# Altium project Ultimate Strat.PrjPcb
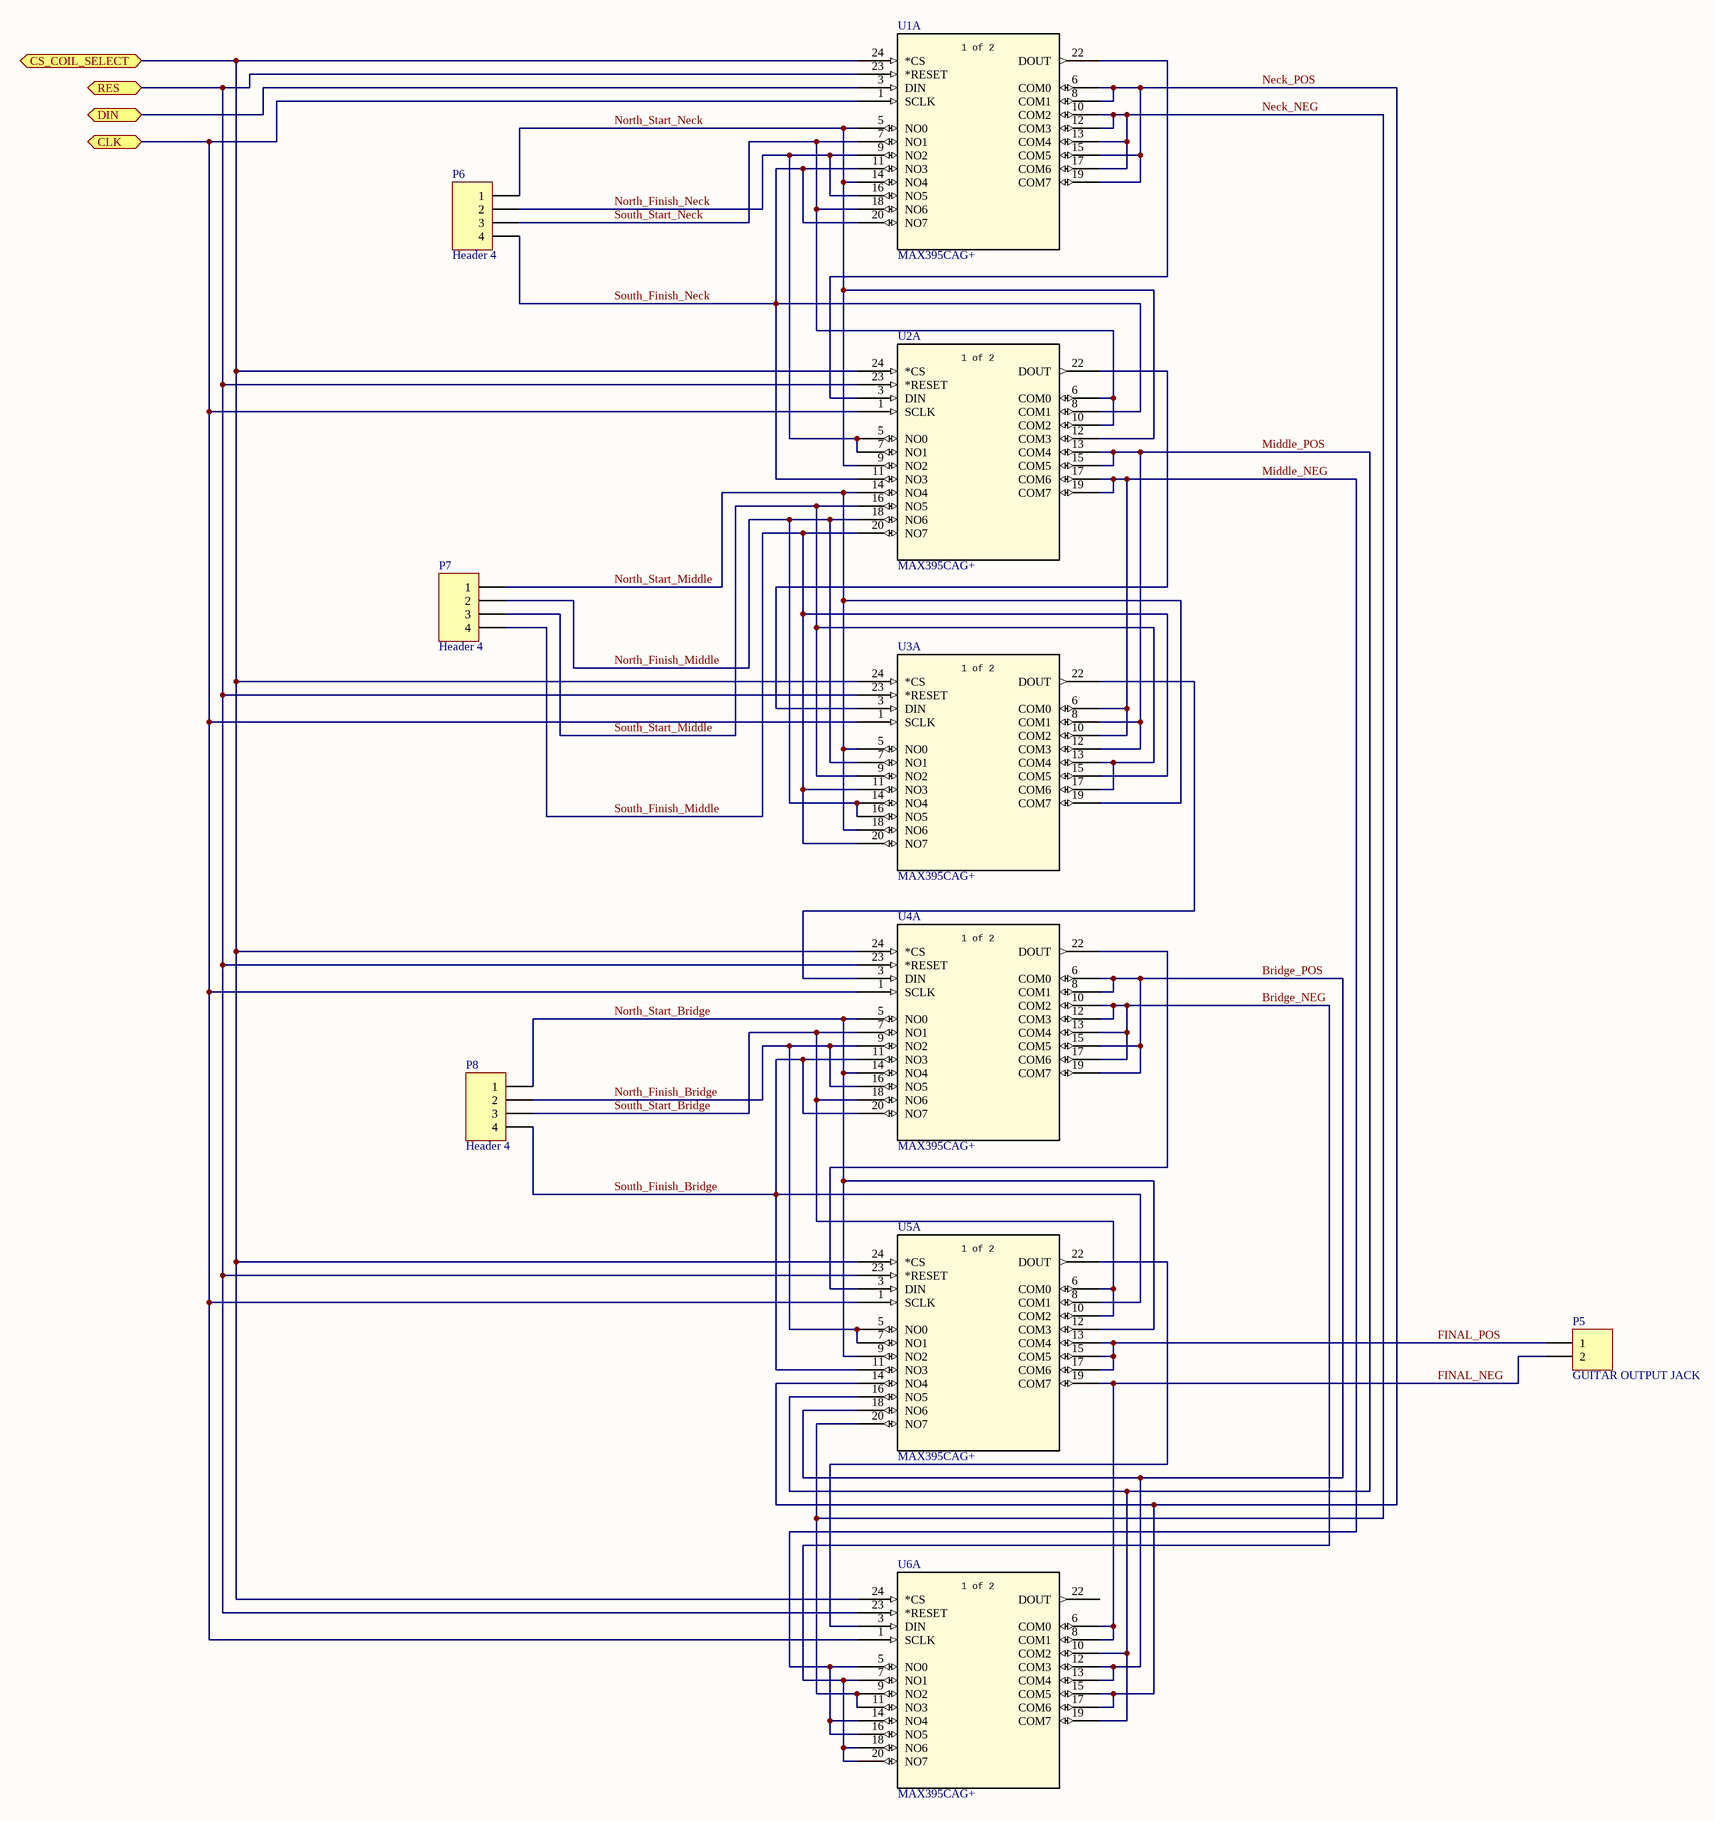
[diagram p0: Coil Switching System.SchDoc]
3 sheets, 37 parts. Net scope: flat (ports and power ports of the same name join across sheets).
Board file: Ultimate_Strat_PCB.PcbDoc
Sheets:
  Coil Switching System.SchDoc
  Power System.SchDoc
  Microcontroller System.SchDoc

## Sheet Coil Switching System.SchDoc
size C

### Parts
P5  GUITAR OUTPUT JACK  [HDR1X2]
P6  Header 4  [HDR1X4]
P7  Header 4  [HDR1X4]
P8  Header 4  [HDR1X4]
U1  MAX395CAG+  [21-0056C_24_MXM]  (part A of 2)
U2  MAX395CAG+  [21-0056C_24_MXM]  (part A of 2)
U3  MAX395CAG+  [21-0056C_24_MXM]  (part A of 2)
U4  MAX395CAG+  [21-0056C_24_MXM]  (part A of 2)
U5  MAX395CAG+  [21-0056C_24_MXM]  (part A of 2)
U6  MAX395CAG+  [21-0056C_24_MXM]  (part A of 2)

### Ports
CLK, CS_COIL_SELECT, DIN, RES

### Nets
Bridge_NEG: U4.10(COM2) U4.12(COM3) U4.13(COM4) U4.17(COM6) U6.7(NO1) U6.18(NO6) U6.20(NO7)
Bridge_POS: U4.6(COM0) U4.8(COM1) U4.15(COM5) U4.19(COM7) U5.18(NO6) U6.12(COM3) U6.13(COM4)
FINAL_NEG: P5.2 U5.19(COM7) U6.6(COM0) U6.8(COM1)
FINAL_POS: P5.1 U5.13(COM4) U5.15(COM5) U5.17(COM6)
Middle_NEG: U2.17(COM6) U2.19(COM7) U3.6(COM0) U3.10(COM2) U6.5(NO0) U6.14(NO4) U6.16(NO5)
Middle_POS: U2.13(COM4) U2.15(COM5) U3.8(COM1) U3.12(COM3) U5.16(NO5) U6.10(COM2) U6.19(COM7)
Neck_NEG: U1.10(COM2) U1.12(COM3) U1.13(COM4) U1.17(COM6) U5.20(NO7) U6.9(NO2) U6.11(NO3)
Neck_POS: U1.6(COM0) U1.8(COM1) U1.15(COM5) U1.19(COM7) U5.14(NO4) U6.15(COM5) U6.17(COM6)
North_Finish_Bridge: P8.2 U4.9(NO2) U4.16(NO5) U5.5(NO0) U5.7(NO1)
North_Finish_Middle: P7.2 U2.18(NO6) U3.7(NO1) U3.14(NO4) U3.16(NO5)
North_Finish_Neck: P6.2 U1.9(NO2) U1.16(NO5) U2.5(NO0) U2.7(NO1)
North_Start_Bridge: P8.1 U4.5(NO0) U4.14(NO4) U5.9(NO2) U5.12(COM3)
North_Start_Middle: P7.1 U2.14(NO4) U3.5(NO0) U3.18(NO6) U3.19(COM7)
North_Start_Neck: P6.1 U1.5(NO0) U1.14(NO4) U2.9(NO2) U2.12(COM3)
South_Finish_Bridge: P8.4 U4.11(NO3) U4.20(NO7) U5.8(COM1) U5.11(NO3)
South_Finish_Middle: P7.4 U2.20(NO7) U3.11(NO3) U3.15(COM5) U3.20(NO7)
South_Finish_Neck: P6.4 U1.11(NO3) U1.20(NO7) U2.8(COM1) U2.11(NO3)
South_Start_Bridge: P8.3 U4.7(NO1) U4.18(NO6) U5.6(COM0) U5.10(COM2)
South_Start_Middle: P7.3 U2.16(NO5) U3.9(NO2) U3.13(COM4) U3.17(COM6)
South_Start_Neck: P6.3 U1.7(NO1) U1.18(NO6) U2.6(COM0) U2.10(COM2)
NetU1_1: U1.1(SCLK) U2.1(SCLK) U3.1(SCLK) U4.1(SCLK) U5.1(SCLK) U6.1(SCLK) ; port CLK
NetU1_3: U1.3(DIN) ; port DIN
NetU1_22: U1.22(DOUT) U2.3(DIN)
NetU1_23: U1.23(*RESET) U2.23(*RESET) U3.23(*RESET) U4.23(*RESET) U5.23(*RESET) U6.23(*RESET) ; port RES
NetU1_24: U1.24(*CS) U2.24(*CS) U3.24(*CS) U4.24(*CS) U5.24(*CS) U6.24(*CS) ; port CS_COIL_SELECT
NetU2_22: U2.22(DOUT) U3.3(DIN)
NetU3_22: U3.22(DOUT) U4.3(DIN)
NetU4_22: U4.22(DOUT) U5.3(DIN)
NetU5_22: U5.22(DOUT) U6.3(DIN)

Not connected (* = marked no-connect by the designer): U6 22(DOUT)

### Notes on the sheet
- (in symbol MAX395CAG+, part A) 1 of 2

### Library data of the parts
P5 = Header 2: Header, 2-Pin; LatestRevisionDate: 17-Jul-2002; LatestRevisionNote: Re-released for DXP Platform.; Publisher: Altium Limited
P6-P8 = Header 4: Header, 4-Pin; LatestRevisionDate: 17-Jul-2002; LatestRevisionNote: Re-released for DXP Platform.; Publisher: Altium Limited
U1-U6 = MAX395CAG+: No Description Available; SourceLibrary: Maxim_2014-05-21; Built_By: EMA_UL_Team; Vendor: Maxim Integrated Products; Manufacturer_Part_Number: MAX395CAG+; Copyright: Copyright (C) 2018 Accelerated Designs. All rights reserved; RefDes: RefDes; Type: DEV

## Sheet Power System.SchDoc
size A
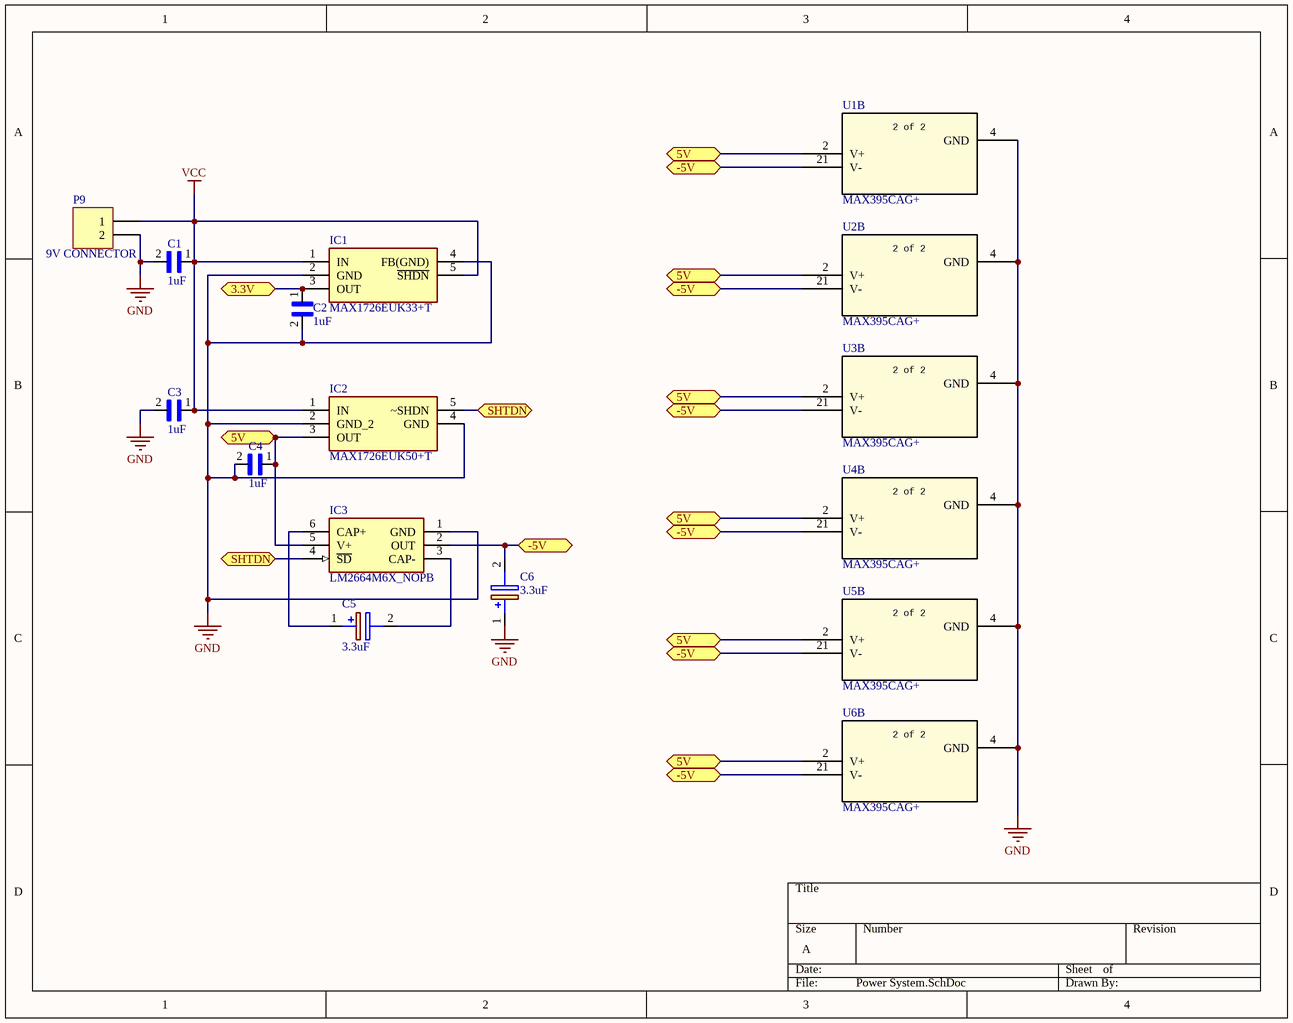
[diagram p1: Power System.SchDoc]

### Parts
C1  1uF  [CAPC2012X135N]
C2  1uF  [CAPC2012X135N]
C3  1uF  [CAPC2012X135N]
C4  1uF  [CAPC2012X135N]
C5  3.3uF  [CAPAE430X550N]
C6  3.3uF  [CAPAE430X550N]
IC1  MAX1726EUK33+T  [SOT95P280X145-5N]
IC2  MAX1726EUK50+T  [SOT95P280X145-5N]
IC3  LM2664M6X_NOPB  [SOT95P280X145-6N]
P9  9V CONNECTOR  [HDR1X2]
U1  MAX395CAG+  [21-0056C_24_MXM]  (part B of 2)
U2  MAX395CAG+  [21-0056C_24_MXM]  (part B of 2)
U3  MAX395CAG+  [21-0056C_24_MXM]  (part B of 2)
U4  MAX395CAG+  [21-0056C_24_MXM]  (part B of 2)
U5  MAX395CAG+  [21-0056C_24_MXM]  (part B of 2)
U6  MAX395CAG+  [21-0056C_24_MXM]  (part B of 2)

### Ports
3.3V, 5V, -5V, SHTDN

### Nets
GND: C1.2 C2.2 C3.2 C4.2 C6.1(+) IC1.2(GND) IC1.4(FB(GND)) IC2.2(GND_2) IC2.4(GND) IC3.1(GND) P9.2 U1.4(GND) U2.4(GND) U3.4(GND) U4.4(GND) U5.4(GND) U6.4(GND)
VCC: C1.1 C3.1 IC1.1(IN) IC1.5(~{SHDN}) IC2.1(IN) P9.1
NetC2_1: C2.1 IC1.3(OUT) ; port 3.3V
NetC4_1: C4.1 IC2.3(OUT) IC3.5(V+) U1.2(V+) U2.2(V+) U3.2(V+) U4.2(V+) U5.2(V+) U6.2(V+) ; port 5V
NetC5_1: C5.1(+) IC3.6(CAP+)
NetC5_2: C5.2(-) IC3.3(CAP-)
NetC6_2: C6.2(-) IC3.2(OUT) U1.21(V-) U2.21(V-) U3.21(V-) U4.21(V-) U5.21(V-) U6.21(V-) ; port -5V
NetIC2_5: IC2.5(~SHDN) IC3.4(~{SD}) ; port SHTDN

### Notes on the sheet
- (in symbol MAX395CAG+, part B) 2 of 2

### Library data of the parts
C1-C4 = TMK212B7105KGHTR: 1ÂµF Â±10% 25V Ceramic Capacitor X7R 0805 _2012 Metric_; MF: Taiyo Yuden; Digi-Key_Part_Number: 587-6357-1-ND; Package: 2012 Taiyo Yuden; MP: TMK212B7105KGHTR; SnapEDA_Link: https://www.snapeda.com/parts/TMK212B7105KGHTR/Taiyo%20Yuden/view-part/1813294/?ref=snap; Digi-Key_Purchase_URL: https://www.digikey.ca/product-detail/en/taiyo-yuden/TMK212B7105KGHTR/587-6357-1-ND/9949943?utm_source=snapeda&utm_medium=aggregator&utm_campaign=symbol; Value: *
C5 C6 = 16SVP3R3M: Capacitor Polarised; Manufacturer_Name: Panasonic; Datasheet Link: https://industrial.panasonic.com/cdbs/www-data/pdf/AAB8000/AAB8000C193.pdf; Height: 5.5mm; Manufacturer_Part_Number: 16SVP3R3M; Arrow Part Number: 16SVP3R3M; Arrow Price/Stock: https://www.arrow.com/en/products/16svp3r3m/panasonic; Mouser Part Number: 667-16SVP3R3M; Mouser Price/Stock: https://www.mouser.com/Search/Refine.aspx?Keyword=667-16SVP3R3M
IC1 = MAX1726EUK33+T: Integrated Circuit; Manufacturer_Name: Maxim Integrated; Datasheet Link: https://datasheets.maximintegrated.com/en/ds/MAX1725-MAX1726.pdf; Height: 1.45mm; Manufacturer_Part_Number: MAX1726EUK33+T; Arrow Part Number: MAX1726EUK33+T; Mouser Part Number: 700-MAX1726EUK33T; Mouser Price/Stock: https://www.mouser.com/Search/Refine.aspx?Keyword=700-MAX1726EUK33T
IC2 = MAX1726EUK50+T: Integrated Circuit; Manufacturer_Name: Maxim Integrated; Datasheet Link: http://componentsearchengine.com/Datasheets/1/MAX1726EUK50+T.pdf; Manufacturer_Part_Number: MAX1726EUK50+T; Arrow Part Number: MAX1726EUK50+T; Mouser Part Number: 700-MAX1726EUK50T; Mouser Price/Stock: https://www.mouser.co.uk/ProductDetail/Maxim-Integrated/MAX1726EUK50%2bT?qs=Jw2w9zrI6w%252Bbrdx6zz2S%2FQ%3D%3D
IC3 = LM2664M6X_NOPB: Integrated Circuit; Manufacturer_Name: Texas Instruments; Manufacturer_Part_Number: LM2664M6X/NOPB; Datasheet Link: https://componentsearchengine.com/Datasheets/2/LM2664M6X_NOPB.pdf; Height: 1.45mm; Arrow Part Number: LM2664M6X/NOPB; Arrow Price/Stock: https://www.arrow.com/en/products/lm2664m6xnopb/texas-instruments; Mouser Part Number: 926-LM2664M6X/NOPB; Mouser Price/Stock: https://www.mouser.co.uk/ProductDetail/Texas-Instruments/LM2664M6X-NOPB?qs=X1J7HmVL2ZHEhyIijWLH%252BA%3D%3D
P9 = Header 2: Header, 2-Pin; LatestRevisionDate: 17-Jul-2002; LatestRevisionNote: Re-released for DXP Platform.; Publisher: Altium Limited
U1-U6 = MAX395CAG+: as U1 on sheet Coil Switching System; Manufacturer_Part_Number: MAX395CAG+; Copyright: Copyright (C) 2018 Accelerated Designs. All rights reserved; RefDes: RefDes; Type: DEV

## Sheet Microcontroller System.SchDoc
size A
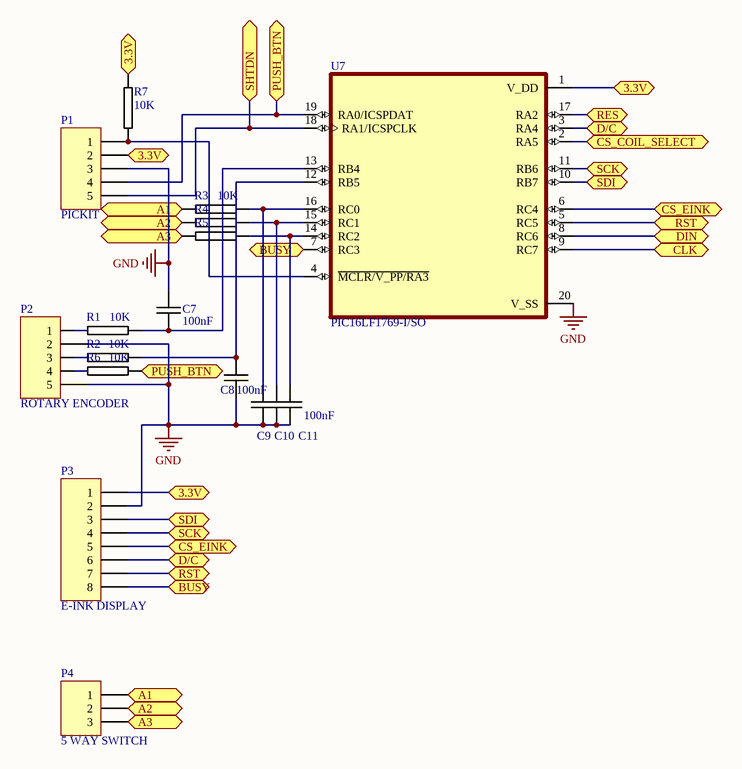
[diagram p2: Microcontroller System.SchDoc]

### Parts
C7  100nF  [0805C-TBD]
C8  100nF  [0805C-TBD]
C9  100nF  [0805C-TBD]  (value not drawn)
C10  100nF  [0805C-TBD]  (value not drawn)
C11  100nF  [0805C-TBD]
P1  PICKIT  [HDR1X5]
P2  ROTARY ENCODER  [HDR1X5]
P3  E-INK DISPLAY  [HDR1X8]
P4  5 WAY SWITCH  [HDR1X3]
R1  10K  [0805R-10K]
R2  10K  [0805R-10K]
R3  10K  [0805R-10K]
R4  10K  [0805R-10K]  (value not drawn)
R5  10K  [0805R-10K]  (value not drawn)
R6  10K  [0805R-10K]
R7  10K  [0805R-10K]
U7  PIC16LF1769-I/SO  [SOIC127P1032X265-20N]

### Ports
3.3V, A1, A2, A3, BUSY, CLK, CS_COIL_SELECT, CS_EINK, D/C, DIN, PUSH_BTN, RES, RST, SCK, SDI, SHTDN

### Nets
GND: C7.1 C8.2 C9.2 C10.2 C11.2 P1.3 P2.2 P2.5 P3.2 U7.20(V_SS)
NetC2_1: P1.2 P3.1 R7.2 U7.1(V_DD) ; port 3.3V
NetC7_2: C7.2 R1.2 U7.13(RB4)
NetC8_1: C8.1 R2.2 U7.12(RB5)
NetC9_1: C9.1 R3.2 U7.16(RC0)
NetC10_1: C10.1 R4.2 U7.15(RC1)
NetC11_1: C11.1 R5.2 U7.14(RC2)
NetIC2_5: P1.5 U7.18(RA1/ICSPCLK) ; port SHTDN
NetP1_1: P1.1 R7.1 U7.4(~{MCLR/V_PP/RA3})
NetP1_4: P1.4 R6.2 U7.19(RA0/ICSPDAT) ; port PUSH_BTN
NetP2_1: P2.1 R1.1
NetP2_3: P2.3 R2.1
NetP2_4: P2.4 R6.1
NetP3_3: P3.3 U7.10(RB7) ; port SDI
NetP3_4: P3.4 U7.11(RB6) ; port SCK
NetP3_5: P3.5 U7.6(RC4) ; port CS_EINK
NetP3_6: P3.6 U7.3(RA4) ; port D/C
NetP3_7: P3.7 U7.5(RC5) ; port RST
NetP3_8: P3.8 U7.7(RC3) ; port BUSY
NetP4_1: P4.1 R3.1 ; port A1
NetP4_2: P4.2 R4.1 ; port A2
NetP4_3: P4.3 R5.1 ; port A3
NetU1_1: U7.9(RC7) ; port CLK
NetU1_3: U7.8(RC6) ; port DIN
NetU1_23: U7.17(RA2) ; port RES
NetU1_24: U7.2(RA5) ; port CS_COIL_SELECT

### Library data of the parts
C7-C11 = 0805C-100nF-25V-X7R-MUR: CAPACITOR 0805 CERAMIC; Supplier 1: Digi-Key; Supplier Part Number 1: 490-1673-1-ND
P1 P2 = Header 5: Header, 5-Pin; LatestRevisionDate: 17-Jul-2002; LatestRevisionNote: Re-released for DXP Platform.; Publisher: Altium Limited
P3 = Header 8: Header, 8-Pin; LatestRevisionDate: 17-Jul-2002; LatestRevisionNote: Re-released for DXP Platform.; Publisher: Altium Limited
P4 = Header 3: Header, 3-Pin; LatestRevisionDate: 17-Jul-2002; LatestRevisionNote: Re-released for DXP Platform.; Publisher: Altium Limited
R1-R7 = 0805R-10K: RESISTOR 0805 1/4 WATT THIN FILM; Reel: *
U7 = PIC16LF1769-I/SO: PIC PICÂ® XLPâ„¢ 16F Microcontroller IC 8-Bit 32MHz 14KB (8K x 14) FLASH 20-SOIC; MF: Microchip; Price: None; Purchase-URL: https://pricing.snapeda.com/search/part/PIC16LF1769-I/SO/?ref=eda; Value: *; Package: SOIC-20 Microchip; SnapEDA_Link: https://www.snapeda.com/parts/PIC16LF1769-I/SO/Microchip/view-part/880488/?ref=snap; Availability: Warning; MP: PIC16LF1769-I/SO

## Nets that join several sheets
GND: Power System (17 pins), Microcontroller System (10 pins)
NetC2_1: Power System (C2.1 IC1.3), Microcontroller System (P1.2 P3.1 R7.2 U7.1)
NetIC2_5: Power System (IC2.5 IC3.4), Microcontroller System (P1.5 U7.18)
NetU1_1: Coil Switching System (6 pins), Microcontroller System (U7.9)
NetU1_3: Coil Switching System (U1.3), Microcontroller System (U7.8)
NetU1_23: Coil Switching System (6 pins), Microcontroller System (U7.17)
NetU1_24: Coil Switching System (6 pins), Microcontroller System (U7.2)